# EAGLE schematic murdock_mcu_v1 (EAGLE 6.2)

## Sheet 1 of 2
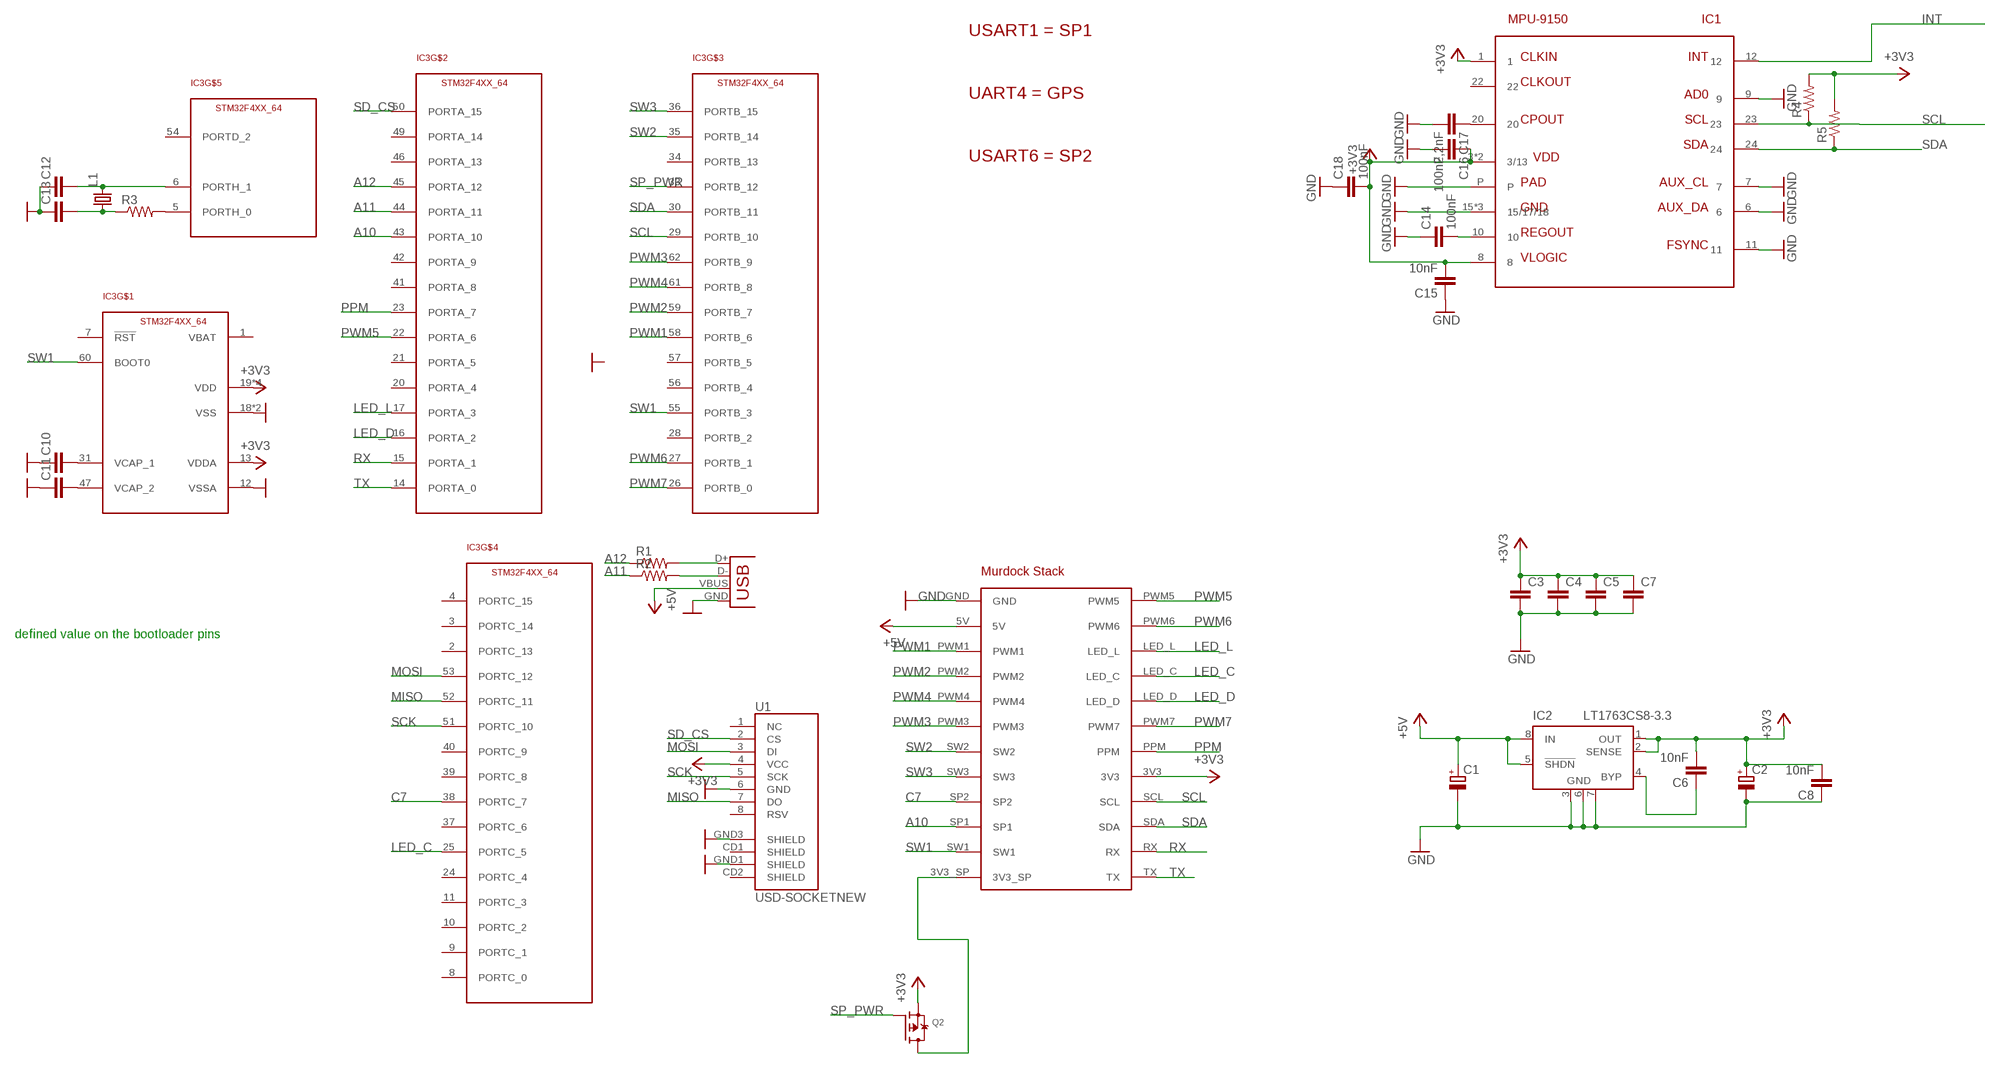
[diagram p0: schematic, sheet 1]

### Parts
C1  CPOL-EUSMCD  [SMC_D]
C2  CPOL-EUSMCD  [SMC_D]
C3  CAP0402-CAP  [0402-CAP]
C4  CAP0402-CAP  [0402-CAP]
C5  CAP0402-CAP  [0402-CAP]
C6  10nF  C-EUC0402  [C0402]
C7  CAP0402-CAP  [0402-CAP]
C8  10nF  C-EUC0402  [C0402]
C10  CAP0805  [0805]
C11  CAP0805  [0805]
C12  CAP0402-CAP  [0402-CAP]
C13  CAP0402-CAP  [0402-CAP]
C14  100nF  CAP0402-CAP  [0402-CAP]
C15  10nF  CAP0402-CAP  [0402-CAP]
C16  100nF  CAP0402-CAP  [0402-CAP]
C17  2,2nF  CAP0402-CAP  [0402-CAP]
C18  100nF  CAP0402-CAP  [0402-CAP]
IC1  MPU-9150  [QFN24]
IC2  LT1763CS8-3.3  [SOIC8]
IC3  STM32F4XX_64  [TQFP64]
L1  X22-OSCILLATOR  [X22]
Q2  MOSFET-P  [SOT23-R]
R1  RESISTOR0402-RES  [0402-RES]
R2  RESISTOR0402-RES  [0402-RES]
R3  RESISTOR0402-RES  [0402-RES]
R4  RESISTOR0402-RES  [0402-RES]
R5  RESISTOR0402-RES  [0402-RES]
U1  USD-SOCKETNEW  [MICRO-SD-SOCKET-PP]
X1  USBSMD  [USB-MINIB]
X2  MURDOCK_STACK  [MURDOCK_STACK]

### Nets
+3V3: C2.+ C3.1 C4.1 C5.1 C6.2 C7.1 C8.2 C15.2 C16.1 C18.2 IC1.1 IC1.3(3/13) IC1.8 IC1.13(3/13) IC2.1(OUT) IC2.2(SENSE) IC3.13(VDDA) IC3.19(VDD) IC3.32(VDD) IC3.48(VDD) IC3.64(VDD) Q2.2(S) R4.2 R5.2 U1.4(VCC) X2.3V3
+5V: C1.+ IC2.5(!SHDN) IC2.8(IN) X1.VBUS X2.5V
A10: IC3.43(PORTA_10) X2.SP1
A11: IC3.44(PORTA_11) R2.1
A12: IC3.45(PORTA_12) R1.1
C7: IC3.38(PORTC_7) X2.SP2
GND: C1.- C2.- C3.2 C4.2 C5.2 C7.2 C8.1 C10.1 C11.1 C12.1 C13.1 C14.1 C15.1 C16.2 C17.2 C18.1 IC1.6 IC1.7 IC1.9 IC1.11 IC1.15(15/17/18) IC1.17(15/17/18) IC1.18(15/17/18) IC1.P IC2.3(GND) IC2.6(GND) IC2.7(GND) IC3.12(VSSA) IC3.18(VSS) IC3.63(VSS) U1.6(GND) U1.GND1(SHIELD) U1.GND3(SHIELD) X1.GND X2.GND
INT: IC1.12
LED_C: IC3.25(PORTC_5) X2.LED_C
LED_D: IC3.16(PORTA_2) X2.LED_D
LED_L: IC3.17(PORTA_3) X2.LED_L
MISO: IC3.52(PORTC_11) U1.7(DO)
MOSI: IC3.53(PORTC_12) U1.3(DI)
N$1: R2.2 X1.D-
N$2: R1.2 X1.D+
N$3: C10.2 IC3.31(VCAP_1)
N$4: C11.2 IC3.47(VCAP_2)
N$5: IC3.5(PORTH_0) R3.2
N$6: C13.2 L1.1 R3.1
N$7: C12.2 IC3.6(PORTH_1) L1.3
N$8: Q2.3(D) X2.3V3_SP
N$9: C14.2 IC1.10
N$10: C17.1 IC1.20
N$13: C6.1 IC2.4(BYP)
PPM: IC3.23(PORTA_7) X2.PPM
PWM1: IC3.58(PORTB_6) X2.PWM1
PWM2: IC3.59(PORTB_7) X2.PWM2
PWM3: IC3.62(PORTB_9) X2.PWM3
PWM4: IC3.61(PORTB_8) X2.PWM4
PWM5: IC3.22(PORTA_6) X2.PWM5
PWM6: IC3.27(PORTB_1) X2.PWM6
PWM7: IC3.26(PORTB_0) X2.PWM7
RX: IC3.15(PORTA_1) X2.RX
SCK: IC3.51(PORTC_10) U1.5(SCK)
SCL: IC1.23 IC3.29(PORTB_10) R4.1 X2.SCL
SD_CS: IC3.50(PORTA_15) U1.2(CS)
SDA: IC1.24 IC3.30(PORTB_11) R5.1 X2.SDA
SP_PWR: IC3.33(PORTB_12) Q2.1(G)
SW1: IC3.55(PORTB_3) IC3.60(BOOT0) X2.SW1
SW2: IC3.35(PORTB_14) X2.SW2
SW3: IC3.36(PORTB_15) X2.SW3
TX: IC3.14(PORTA_0) X2.TX
Unconnected: IC1.22 IC3.1(VBAT) IC3.2(PORTC_13) IC3.3(PORTC_14) IC3.4(PORTC_15) IC3.7(!RST) IC3.8(PORTC_0) IC3.9(PORTC_1) IC3.10(PORTC_2) IC3.11(PORTC_3) IC3.20(PORTA_4) IC3.21(PORTA_5) IC3.24(PORTC_4) IC3.28(PORTB_2) IC3.34(PORTB_13) IC3.37(PORTC_6) IC3.39(PORTC_8) IC3.40(PORTC_9) IC3.41(PORTA_8) IC3.42(PORTA_9) IC3.46(PORTA_13) IC3.49(PORTA_14) IC3.54(PORTD_2) IC3.56(PORTB_4) IC3.57(PORTB_5) U1.1(NC) U1.8(RSV) U1.CD1(SHIELD) U1.CD2(SHIELD)

### Notes on the sheet
- USART1 = SP1
- UART4 = GPS
- USART6 = SP2
- defined value on the bootloader pins

## Sheet 2 of 2

## Library data of the parts
C1 C2 = rcl:CPOL-EU: POLARIZED CAPACITOR, European symbol
C3-C5 C7 C10-C13 = SparkFun-Capacitors:CAP: Capacitor Standard 0603 ceramic capacitor, and 0.1" leaded capacitor.
C6 C8 = rcl:C-EU: CAPACITOR, European symbol
C14-C18 = SparkFun:CAP: Capacitor Standard 0603 ceramic capacitor, and 0.1" leaded capacitor.
IC1 = seb:MPU-9150
IC2 = linear-technology:LT1763CS8: 500mA, Low Noise, LDO Micropower Regulators Source: http://cds.linear.com/docs/Datasheet/1763ff.pdf; MPN: LT1763CS8-3.3; OC_FARNELL: 1273617; OC_NEWARK: 57M6055
IC3 = stm32:STM32F4XX_64
L1 = seb:X22-OSCILLATOR
Q2 = microbuilder:MOSFET-P: P-Channel Mosfet LEGEND VDS: Voltage Drain-Source ID: Drain Current RDS(ON): Drain-Source On-State Resistance VGS(TH): Gate-Source Threshold Voltage CISS: Drain-Source Input Capacitance SOT-23 Name VDS ID RDS(ON) VGS(TH) CISS Order Number IRLML5103 30V 760mA 600 mOhm -- 75pF @ 25V Digikey: IRLML5103PBFCT-ND IRLML6401 12V 4.3A 50 mOhm 950mV @ 250µA 830pF @ 10V Digikey: IRLML6401PBFTR-ND NTR0202PL 20V 400mA 800 mOhm 2.3V @ 250uA 70pF @ 5V Digikey: NTR0202PLT1GOSTR-ND NTR4101PT1G 20V 1.8A 85 mOhm 1.2V @ 250uA 675pF @ 10V Digikey: NTR4101PT1GOSCT-ND DMP2004K 20V 600mA 900 mOhm 1V @ 250uA 175pF @ 16V Digikey: DMP2004KDICT-ND PMV65XP 20V 3.9A 76 mOhm 950mV @ 1mA 725pF @ 20V Digikey: 568-2358-2-ND TO-252 Name VDS ID RDS(ON) VGS(TH) CISS Order Number AOD417 30V 25A 34 mOhm 3V @ 250µA 920pF @ 15V Digikey: 785-1106-2-ND
R1-R3 = SparkFun-Resistors:RESISTOR: Resistor
R4 R5 = SparkFun:RESISTOR: Resistor
U1 = SparkFun-Connectors:USD-SOCKET: microSD Socket Push-push type uSD socket. Schematic element and footprint production proven. Spark Fun Electronics SKU : PRT-00127. tDoc lines correctly indicate media card edge positions when inserting (unlocked, locked, depressed).
X1 = SparkFun-Connectors:USB: USB Connectors USB-B-PTH is fully proven SKU : PRT-00139 USB-miniB is fully proven SKU : PRT-00587 USB-A-PCB is untested. USB-A-H is throughly reviewed, but untested. Spark Fun Electronics SKU : PRT-00437 USB-B-SMT is throughly reviewed, but untested. Needs silkscreen touching up. USB-A-S has not been used/tested USB-MB-H has not been used/tested
X2 = murdock:MURDOCK_STACK